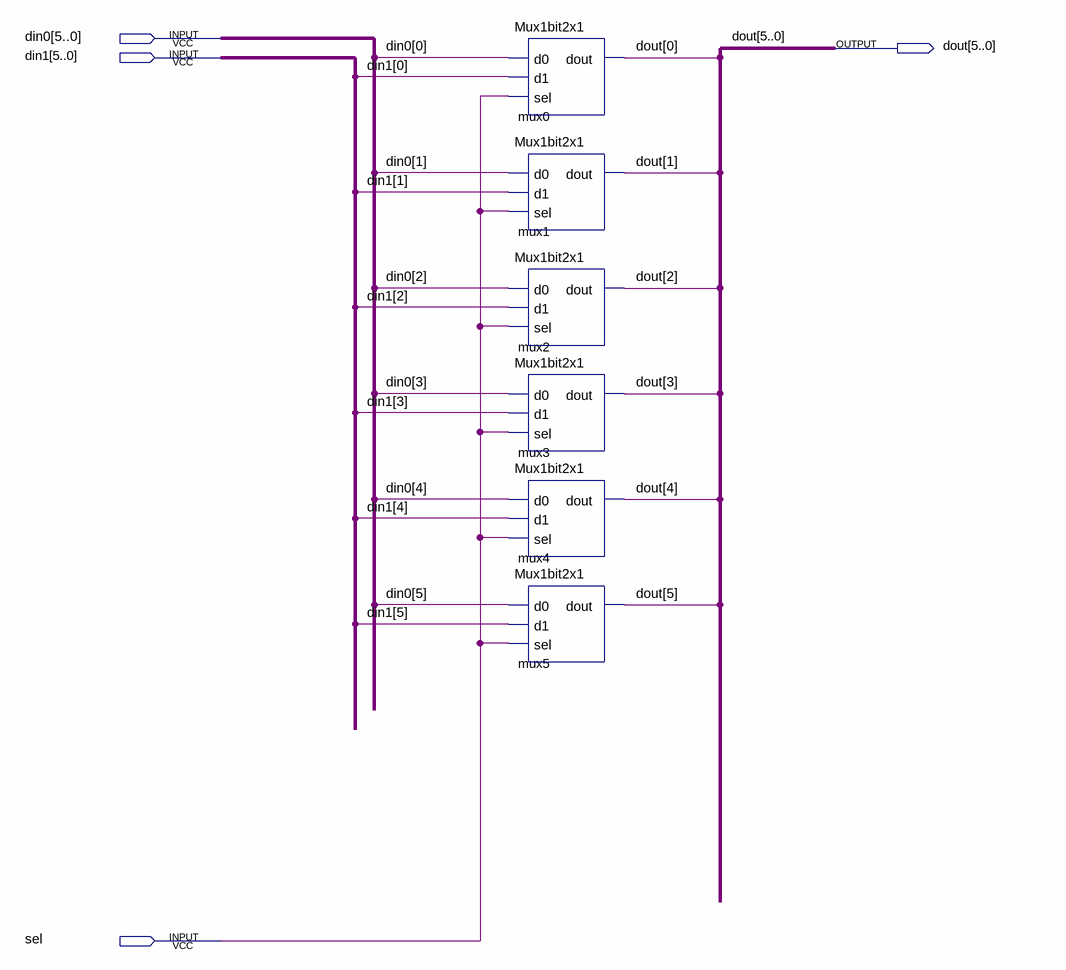
[diagram p0: schematic sheet]
// Quartus schematic Mux6bit2x1.bdf as structural Verilog: 6 symbols, 4 pins
module Mux6bit2x1 (
  input  [5:0] din0,
  input  [5:0] din1,
  input  sel,
  output [5:0] dout
);

  Mux1bit2x1 mux0 (.d0(din0[0]), .d1(din1[0]), .sel(sel), .dout(dout[0]));
  Mux1bit2x1 mux1 (.d0(din0[1]), .d1(din1[1]), .sel(sel), .dout(dout[1]));
  Mux1bit2x1 mux2 (.d0(din0[2]), .d1(din1[2]), .sel(sel), .dout(dout[2]));
  Mux1bit2x1 mux3 (.d0(din0[3]), .d1(din1[3]), .sel(sel), .dout(dout[3]));
  Mux1bit2x1 mux4 (.d0(din0[4]), .d1(din1[4]), .sel(sel), .dout(dout[4]));
  Mux1bit2x1 mux5 (.d0(din0[5]), .d1(din1[5]), .sel(sel), .dout(dout[5]));
endmodule
